# Altium schematic sheet charge_controller_sch.SchDoc
size A; SheetNumber: 1; SheetTotal: 1
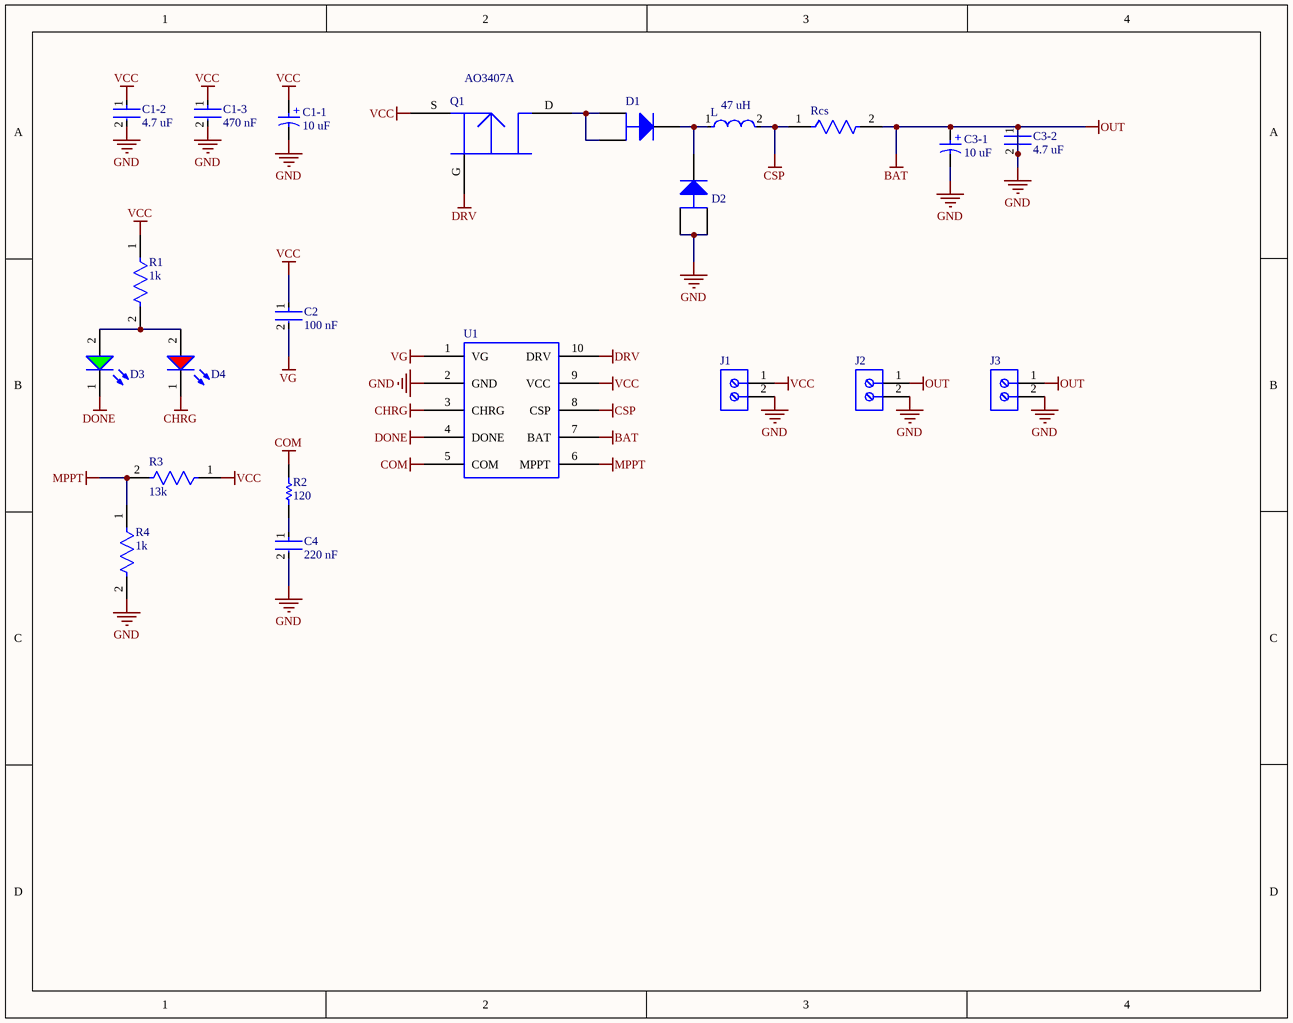
[diagram p0: charge_controller_sch.SchDoc]

## Parts
C1-1  10 uF  [WCAP-AS5H_D5H5.5]
C1-2  4.7 uF  [FP-CL10-IPC_C]
C1-3  470 nF  [FP-GRM21B-0_1-IPC_B]
C2  100 nF  [FP-CC0805-0_85-MFG]
C3-1  10 uF  [WCAP-AS5H_D5H5.5]
C3-2  4.7 uF  [FP-CL10-IPC_C]
C4  220 nF  [FP-C0805C-DN-MFG]
D1  SS8P3L-M3/86A  [VISH-SS8P3L-TO-277A-3_V]  (value not drawn)
D2  SS8P3L-M3/86A  [VISH-SS8P3L-TO-277A-3_V]  (value not drawn)
D3  150060VS75000  [WL-SMCW_0603_150060xx75000]  (value not drawn)
D4  150060RS75000  [WL-SMCW_0603_150060xx75000]  (value not drawn)
J1  691137710002  [691137710002]  (value not drawn)
J2  691137710002  [691137710002]  (value not drawn)
J3  691137710002  [691137710002]  (value not drawn)
L  47 uH  [FP-LB3218-1_8-0_2-IPC_A]
Q1  AO3407A  [AO3407A]
R1  1k  [FP-RR1220-IPC_A]
R2  120  [RESC2013X50X40ML20T20]
R3  13k  [FP-RMCF0805-MFG]
R4  1k  [FP-RR1220-IPC_A]
Rcs  CR2512-J/-000ELF  [FP-CR2512-IPC_C]  (value not drawn)
U1  C81968  [CN3767]  (value not drawn)

## Nets
BAT: C1-1.2(N) C1-2.2 C1-3.2 C3-1.1(P) C3-1.2(N) C3-2.1 C3-2.2 C4.2 D2.1(A1) D2.2(A2) J1.2 J2.1 J2.2 J3.1 J3.2 R4.2 Rcs.2 U1.2(GND) U1.7(BAT)  [also labelled GND, OUT]
CHRG: D4.1(K) U1.3(CHRG)
COM: R2.2 U1.5(COM)
CSP: L.2 Rcs.1 U1.8(CSP)
DONE: D3.1(K) U1.4(DONE)
DRV: Q1.G U1.10(DRV)
MPPT: R3.2 R4.1 U1.6(MPPT)
VCC: C1-1.1(P) C1-2.1 C1-3.1 C2.1 J1.1 Q1.S R1.1 R3.1 U1.9(VCC)
VG: C2.2 U1.1(VG)
NetC4_1: C4.1 R2.1
NetD1_1: D1.1(A1) D1.2(A2) Q1.D
NetD1_3: D1.3(K) D2.3(K) L.1
NetD3_2: D3.2(A) D4.2(A) R1.2

## Notes on the sheet
- (in symbol CMP-03913-53914689-1) +

## Library data of the parts
C1-1 C3-1 = CMP-03913-53914689-1: 865230542002 WCAP-AS5H Aluminum Electrolytic Capacitors; Voltage Rating (DC): 35V; Insulation Resistance: 10MΩ; Capacitance: 10µF; Tolerance: 20%; Ripple Current (AC): 25mA; Polarity: Polar; Leakage Current: 3.5µA; Life (Hours): 5000hours; Max Operating Temperature: 105°C; Width: 5.3mm; Mount: Surface Mount; Case/Package: Radial; Height: 5.5mm; Diameter: 5mm; Length: 5.5mm; Min Operating Temperature: -40°C; Voltage Rating: 35V; REACH SVHC: Unknown; Ripple Current: 25mA; Height - Seated (Max): 5.5118mm; Packaging: Tape & Reel (TR); NexarPartId: 53914689; RoHS: Compliant
C1-2 C3-2 = CMP-13271-003017-1: Cap Ceramic 4.7uF 10V X5R ±10% Pad SMD 0603 +85°C T/R; Capacitance: 4.7uF; Case/Package: 0603; Packaging: Tape and Reel; Width: 0.031inch; Contact Plating: Tin; Thickness: 0.035inch; Package Quantity: 1; Voltage Rating: 10V; Case Code (Metric): 1608; Case Code (Imperial): 0603; Depth: 0.8mm; Height: 0.8mm; Tolerance: 10%; Max Operating Temperature: 85°C; Length: 1.6mm; Dielectric: X5R; Mount: Surface Mount; Radiation Hardening: No; Min Operating Temperature: -55°C
C1-3 = CMP-06035-060025-1: Chip Multilayer Ceramic Capacitors for General Purpose, 0805, 0.47uF, X7R, 15%, 10%, 50V; Capacitance: 470nF; Material: Ceramic; Voltage Rating: 50V; Case Code (Imperial): 0805; Depth: 1.25mm; Voltage Rating (DC): 50V; Dielectric: X7R; Construction: Flat; Min Operating Temperature: -55°C; Size: 1.25mm; Package Quantity: 1; Series: GRM; Width: 0.049inch; Case/Package: 0805; Lead Free: Lead Free; Thickness: 0.053inch; Case Code (Metric): 2012; Length: 2mm; Height: 1.25mm; Termination: SMD/SMT; Mount: Surface Mount; Voltage: 50V; Packaging: Tape and Reel; Max Operating Temperature: 125°C; REACH SVHC: No SVHC; Tolerance: 10%
C2 = CMP-2100-03606-3: CAP CER 0.1UF 50V X7R 0805; Manufacturer Part Number: CC0805KRX7R9BB104; Manufacturer: Yageo; Tolerance: 0.1; Material: Ceramic; Device Class L1: Passive Components; ComponentLink2Description: Datasheet; Package: CC0805-0.85; Digikey Description: CAP CER 0.1UF 50V X7R 0805; Capacitance: 100 nF; Device Class L3: Ceramic Capacitors; Value: 100 nF; Temperature: -30°C to +85°C; Temperature Characteristic: X7R; Voltage Rating: 50 V; Height: 0.95mm; RoHS: TRUE; Ipc Land Pattern Name: CAPC200125X85; Device Class L2: Capacitors; Category: Cap; Temperature Range Low: -30°C; Temperature Range High: +85°C; Mouser Description: Multilayer Ceramic Capacitors MLCC - SMD/SMT 100nF 50V X7R 10%; Footprint Url: http://www.yageo.com/exep/pages/download/literatures/UPY-C_GEN_24.pdf; Automotive: No; Octopart: https://octopart.com/cc0805krx7r9bb104-yageo-192993; Lead Free: Yes; ComponentLink2URL: http://www.yageo.com/documents/recent/UPY-GPHC_Y5V_6.3V-to-50V_8.pdf
C4 = CMP-1036-04552-2: CAP CER 0.22UF 50V X7R 0805; Manufacturer: KEMET; Manufacturer Part Number: C0805C224K5RACTU; Value: 0.22 μF; Temperature Coefficient: 30ppm/°C; Material: Ceramic; Tolerance: 0.1; ComponentLink2URL: https://content.kemet.com/datasheets/KEM_C1003_C0G_SMD.pdf; Temperature Characteristic: X7R; Device Class L3: Ceramic Capacitors; Lead Free: Yes; Temperature: -55°C to +125°C; RoHS: TRUE; Capacitance: 0.22 μF; Automotive: No; Octopart: https://octopart.com/c0805c224k5ractu-kemet-144670; Temperature Range Low: -55°C; Height: 0.88mm; Device Class L1: Passive Components; Digikey Description: CAP CER 0.22UF 50V X7R 0805; ComponentLink2Description: Datasheet; Mouser Description: CAP CER 0.22UF 50V X7R 0805; Category: Cap; Ipc Land Pattern Name: CAPC200125X78; Temperature Range High: +125°C; Package: C0805C-DN; Device Class L2: Capacitors; Voltage Rating: 50 V
D1 D2 = CMP-0545-00001-2: High Current Density Surface Mount Schottky Barrier Rectifier, 30 V, -55 to 155 degC, 3-pin TO-277A, Pb-Free, Tape and Reel; Manufacturer: Vishay Semiconductor; IF(AV): 8.0 A; VRRM: 30 V; Typical Junction Capacitance: 330 pF; EAS: 20 mJ; VF at IF: 8.0 A=0.472 V; IFSM: 150 A; DatasheetVersion: 28/06/2012; ComponentLink3Description: Package Specification; Packing: Tape and Reel; ComponentLink1Description: Manufacturer URL; ComponentLink2Description: Datasheet; PackageDescription: 3-Pin TO-277A (SMPC), Body 4.3 x 6.1 mm; ComponentLink1URL: http://www.vishay.com/; RoHS: TRUE; Mounting Technology: Surface Mount; ComponentLink3URL: http://www.vishay.com/docs/89001/ss8p3l.pdf; ComponentLink2URL: http://www.vishay.com/docs/89001/ss8p3l.pdf; PartNumber: SS8P3L-M3/86A; PackageReference: TO-277A-3; Operating Junction and Storage Temperature Range: -55 to 150 degC
D3 = CMP-1426-00006-7: WURTH ELEKTRONIK - 150060VS75000 - LED, Green, SMD, 0603, 30 mA, 2 V, 570 nm; Reverse Voltage: 5V; Power Dissipation: 72mW; Dominant Wavelength: 570nm; Peak Wavelength: 572nm; Forward Current: 100mA; Forward Voltage: 2V; Lens Style: Clear, Rectangular; Test Current: 20mA; Max Junction Temperature (Tj): 95°C; Viewing Angle: 140°; Luminous Intensity: 40mcd; Height: 700µm; Width: 800µm; Length: 1.6mm; Mount: Surface Mount; Min Operating Temperature: -40°C; Max Reverse Voltage (DC): 5V; Case Code (Imperial): 0603; Wavelength: 570nm; Color: Green; REACH SVHC: Unknown; RoHS: Compliant; Max Operating Temperature: 85°C; Packaging: Tape and Reel; Case/Package: 0603; Number of Pins: 2; Case Code (Metric): 1608
D4 = CMP-1426-00001-4: LED Low-Power Uni-Color Red 630nm 2V 2-Pin Chip 0603(1608Metric) T/R; Max Junction Temperature (Tj): 95°C; Dominant Wavelength: 625nm; Lens Style: Clear, Rectangular; Viewing Angle: 140°; Forward Current: 100mA; Max Reverse Voltage (DC): 5V; Luminous Intensity: 250mcd; Test Current: 20mA; Power Dissipation: 72mW; Max Operating Temperature: 85°C; Mount: Surface Mount; Height: 700µm; Packaging: Tape and Reel; REACH SVHC: Unknown; Case Code (Metric): 1608; Peak Wavelength: 630nm; Forward Voltage: 2V; Case/Package: 0603; Color: Red; RoHS: Compliant; Width: 800µm; Reverse Voltage: 5V; Min Operating Temperature: -40°C; Wavelength: 625nm; Case Code (Imperial): 0603; Length: 1.6mm
J1-J3 = CMP-1502-03324-2: NexarPartId: 78871135; Voltage Rating: 300V; Number of Contacts: 2; Current Rating: 16A; Lead Pitch: 5mm; Height: 11.6mm; Packaging: Box; RoHS: Non-Compliant; Contact Material: Nickel, Tin; Max Operating Temperature: 120°C; Number of Pins: 2; Min Operating Temperature: -30°C; Number of Rows: 1
L = CMP-14484-000479-1: SMD Inductors 47uH ±10% 0.205A 1.196Ω 1207; Test Frequency: 2.52MHz; Core Material: Ferrite; DC Resistance (DCR): 920mR; Max DC Current: 205mA; Shielding: Unshielded; Self Resonant Frequency: 12MHz; Tolerance: 10%; Mount: Surface Mount; Width: 1.8mm; Lead Pitch: 1.7mm; Package Quantity: 2000; Case Code (Imperial): 1207; Case/Package: 1207; Halogen Free: Halogen Free; Height - Seated (Max): 0.08inch; Series: LB; Length: 3.2mm; Radiation Hardening: No; DC Current: 205mA; Lead Free: Lead Free; Military Standard: Not; Depth: 2mm; Current Rating: 205mA; Min Operating Temperature: -40°C; RoHS Compliant: Yes; Case Code (Metric): 3218; Inductance: 47uH; Number of Pins: 2; Resistor Type: Wirewound; Max Operating Temperature: 105°C; Termination: SMD/SMT; Packaging: Tape and Reel; Height: 1.8mm
R1 R4 = CMP-2001-03210-2: 1kΩ ±0.5% 0.1W 1/10W Chip Resistor 0805 (2012 Metric) Thin Film; Voltage Rating (DC): 100V; Temperature Coefficient: 25ppm/°C; Power Rating: 100mW; Resistance: 1kR; Packaging: Tape and Reel; Max Operating Temperature: 125°C; Resistor Type: Thin Film; Length: 2mm; Number of Terminations: 2; Resistance Tolerance: 0.5%; Termination: SMD/SMT; Height: 0.4mm; Max Power Dissipation: 100mW; Lead Free: Lead Free; Min Operating Temperature: -55°C; Size Code: 0805; Voltage Rating: 100V; Package Quantity: 1; Width: 1.25mm; Depth: 1.25mm; Case/Package: 0805; Case Code (Imperial): 0805; Case Code (Metric): 2012; Tolerance: 0.5%; Series: RR; RoHS Compliant: Yes; Technology: THIN FILM
R2 = CMP-2001-04810-1: Part Number: RG2012N-121-W-T1; Manufacturer: Susumu
R3 = CMP-26527-004824-1: 13kΩ ±1% 0.125W 0805 Thick Film Chip Resistor AEC-Q200 compliant; Max Power Dissipation: 125mW; Temperature Coefficient: 100ppm/°C; Resistance: 13kR; Contact Plating: Tin; Min Operating Temperature: -55°C; Series: RMCF; Military Standard: Not; Features: Automotive AEC-Q200; Case/Package: 0805; Construction: Rectangular; Max Operating Temperature: 155°C; Width: 0.049inch; Radiation Hardening: No; Height: 0.026inch; Case Code (Metric): 2012; Resistor Type: Thick Film; Depth: 1.25mm; Case Code (Imperial): 0805; RoHS Compliant: Yes; Mount: Surface Mount; Length: 2mm; Number of Terminations: 2; Tolerance: 1%; Packaging: Tape and Reel
Rcs = CMP-07231-001301-1: Thick Film Chip Resistors 2512 0Ω 1W 5%; Resistance: 0mR; Voltage Rating: 200V; Temperature Coefficient: 500ppm/°C; Max Operating Temperature: 155°C; Depth: 3.1mm; Case Code (Metric): 6332; REACH SVHC: No SVHC; Packaging: Tape and Reel; Min Operating Temperature: -55°C; Case Code (Imperial): 2512; Power Rating: 1W; Composition: Thick Film; Radiation Hardening: No; Contact Plating: Tin; Military Standard: Not; Termination: SMD/SMT; Max Power Dissipation: 1W; Tolerance: 5%; Mount: Surface Mount; Case/Package: 2512; Voltage Rating (DC): 200V; Length: 6.3mm
U1 = CN3767